# Altium project project_14.PrjPcb
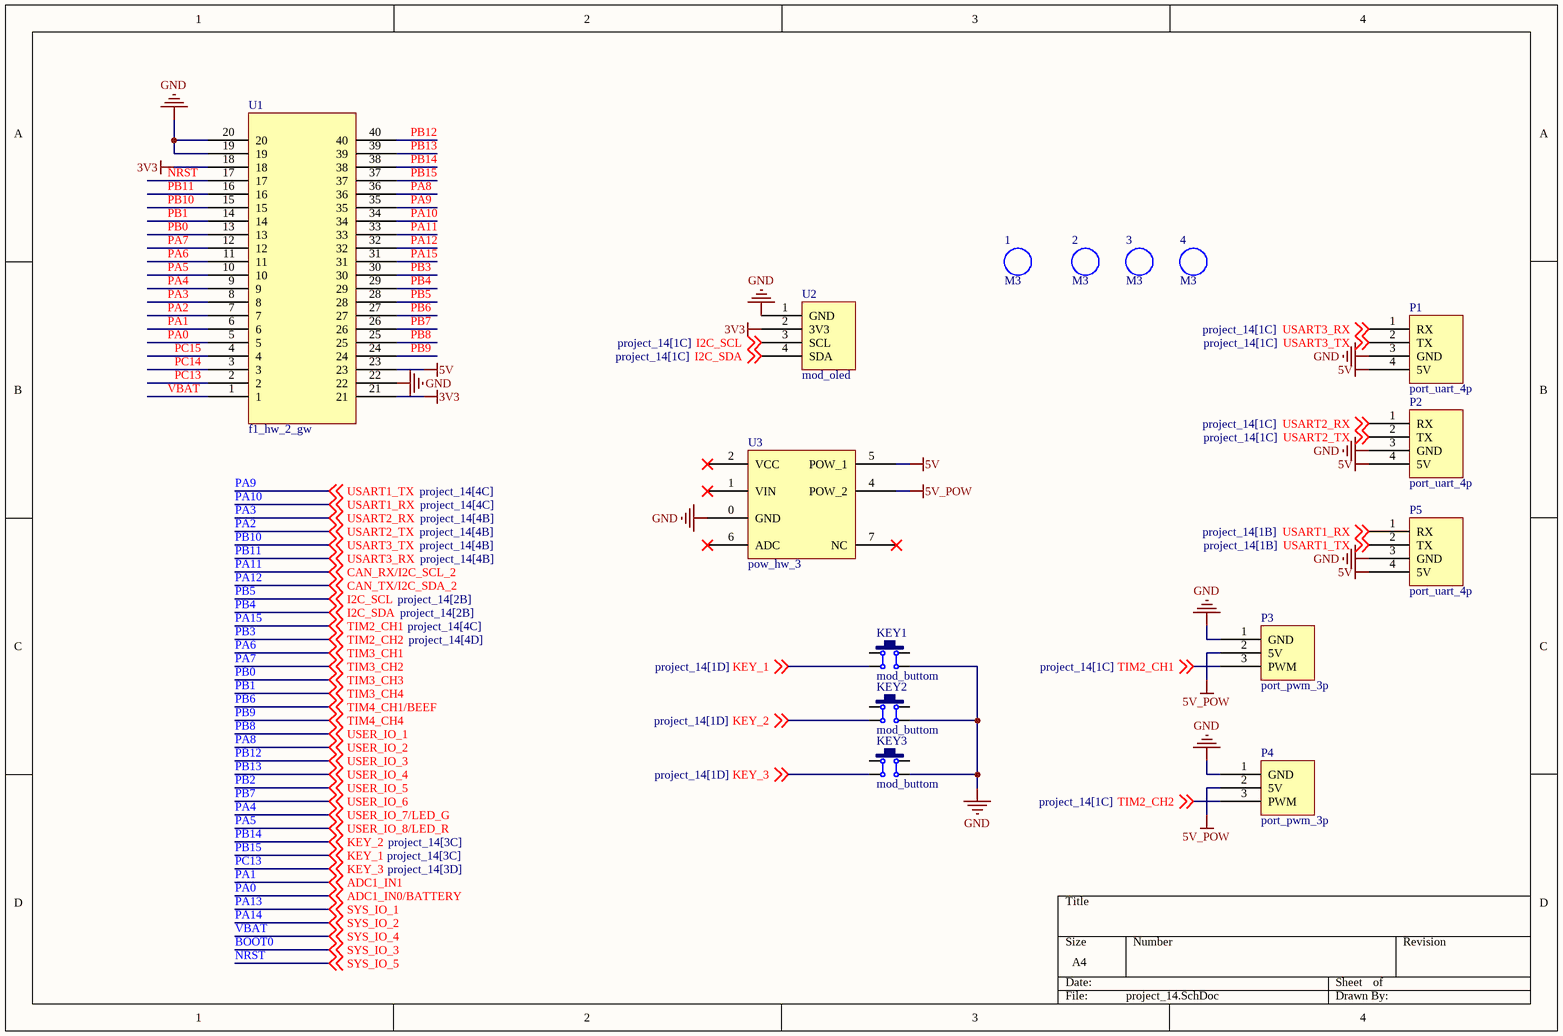
[diagram p0: project_14.SchDoc]
1 sheet, 15 parts. Net scope: global (net labels, ports and power ports of the same name join across sheets).
Board file: project_14.PcbDoc

## Sheet project_14.SchDoc
size A4; SheetNumber: 1; SheetTotal: 1

### Parts
1  M3  [M3 125X200]
2  M3  [M3 125X200]
3  M3  [M3 125X200]
4  M3  [M3 125X200]
KEY1  mod_buttom  [MOD_BUTTOM]
KEY2  mod_buttom  [MOD_BUTTOM]
KEY3  mod_buttom  [MOD_BUTTOM]
P1  port_uart_4p  [XH2.54_4P]
P2  port_uart_4p  [XH2.54_4P]
P3  port_pwm_3p  [XH2.54_3P]
P4  port_pwm_3p  [XH2.54_3P]
P5  port_uart_4p  [XH2.54_4P]
U1  f1_hw_2_gw  [F1_HW_2_GW]
U2  mod_oled  [MOD_OLED]
U3  pow_hw_3  [POW_HW_3]

### Nets
3V3: U1.18 U1.21 U2.2(3V3)
5V: P1.4(5V) P2.4(5V) P5.4(5V) U1.23 U3.5(POW_1)
5V_POW: P3.2(5V) P4.2(5V) U3.4(POW_2)
GND: KEY1.3 KEY2.3 KEY3.3 P1.3(GND) P2.3(GND) P3.1(GND) P4.1(GND) P5.3(GND) U1.19 U1.20 U1.22 U2.1(GND) U3.0(GND)
NRST: U1.17 ; off-sheet SYS_IO_5  [also labelled SYS_IO_5]
PA0: U1.5 ; off-sheet ADC1_IN0/BATTERY  [also labelled ADC1_IN0/BATTERY]
PA1: U1.6 ; off-sheet ADC1_IN1  [also labelled ADC1_IN1]
PA2: P2.2(TX) U1.7 ; off-sheet USART2_TX  [also labelled USART2_TX]
PA3: P2.1(RX) U1.8 ; off-sheet USART2_RX  [also labelled USART2_RX]
PA4: U1.9 ; off-sheet USER_IO_7/LED_G  [also labelled USER_IO_7/LED_G]
PA5: U1.10 ; off-sheet USER_IO_8/LED_R  [also labelled USER_IO_8/LED_R]
PA6: U1.11 ; off-sheet TIM3_CH1  [also labelled TIM3_CH1]
PA7: U1.12 ; off-sheet TIM3_CH2  [also labelled TIM3_CH2]
PA8: U1.36 ; off-sheet USER_IO_2  [also labelled USER_IO_2]
PA9: P5.2(TX) U1.35 ; off-sheet USART1_TX  [also labelled USART1_TX]
PA10: P5.1(RX) U1.34 ; off-sheet USART1_RX  [also labelled USART1_RX]
PA11: U1.33 ; off-sheet CAN_RX/I2C_SCL_2  [also labelled CAN_RX/I2C_SCL_2]
PA12: U1.32 ; off-sheet CAN_TX/I2C_SDA_2  [also labelled CAN_TX/I2C_SDA_2]
PA15: P3.3(PWM) U1.31 ; off-sheet TIM2_CH1  [also labelled TIM2_CH1]
PB0: U1.13 ; off-sheet TIM3_CH3  [also labelled TIM3_CH3]
PB1: U1.14 ; off-sheet TIM3_CH4  [also labelled TIM3_CH4]
PB3: P4.3(PWM) U1.30 ; off-sheet TIM2_CH2  [also labelled TIM2_CH2]
PB4: U1.29 U2.4(SDA) ; off-sheet I2C_SDA  [also labelled I2C_SDA]
PB5: U1.28 U2.3(SCL) ; off-sheet I2C_SCL  [also labelled I2C_SCL]
PB6: U1.27 ; off-sheet TIM4_CH1/BEEF  [also labelled TIM4_CH1/BEEF]
PB7: U1.26 ; off-sheet USER_IO_6  [also labelled USER_IO_6]
PB8: U1.25 ; off-sheet USER_IO_1  [also labelled USER_IO_1]
PB9: U1.24 ; off-sheet TIM4_CH4  [also labelled TIM4_CH4]
PB10: P1.2(TX) U1.15 ; off-sheet USART3_TX  [also labelled USART3_TX]
PB11: P1.1(RX) U1.16 ; off-sheet USART3_RX  [also labelled USART3_RX]
PB12: U1.40 ; off-sheet USER_IO_3  [also labelled USER_IO_3]
PB13: U1.39 ; off-sheet USER_IO_4  [also labelled USER_IO_4]
PB14: KEY2.4 U1.38 ; off-sheet KEY_2  [also labelled KEY_2]
PB15: KEY1.4 U1.37 ; off-sheet KEY_1  [also labelled KEY_1]
PC13: KEY3.4 U1.2 ; off-sheet KEY_3  [also labelled KEY_3]
PC14: U1.3
PC15: U1.4
VBAT: U1.1 ; off-sheet SYS_IO_4  [also labelled SYS_IO_4]

Not connected (* = marked no-connect by the designer): KEY1 1 2; KEY2 1 2; KEY3 1 2; U3 1(VIN)* 2(VCC)* 6(ADC)* 7(NC)*

### Library data of the parts
1-4 = prot_m3: m3铜柱孔; BOM名称: 铜柱孔; 版权归属: 源创客; 学习资源: www.ooocke.com
KEY1-KEY3 = mod_buttom: 6*6*4.3按键
P1 P2 P5 = port_uart_4p: 串口接口/SPP蓝牙模块 / XH2.54弯排针4p/4p排母
P3 P4 = port_pwm_3p: 舵机接口 / XH2.54弯排针3p
U2 = mod_oled: oled模块 / 4p排母
U3 = pow_hw_3: 两路降压电源模块